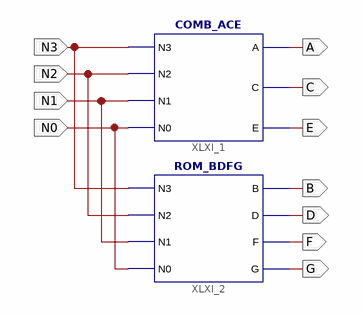
[diagram p0: schematic sheet 1]
// Xilinx ISE schematic SEVEN_SEG_DECODER.sch (spartan3e) as structural Verilog: 2 symbols, 11 ports
module SEVEN_SEG_DECODER (
  input  N3,
  input  N2,
  input  N1,
  input  N0,
  output A,
  output C,
  output E,
  output B,
  output D,
  output F,
  output G
);

  COMB_ACE XLXI_1 (.N3(N3), .N2(N2), .N1(N1), .N0(N0), .A(A), .C(C), .E(E));
  ROM_BDFG XLXI_2 (.N3(N3), .N2(N2), .N1(N1), .N0(N0), .B(B), .D(D), .F(F), .G(G));
endmodule
